# Altium schematic sheet Half_Bridge_Driver.SchDoc
size A; SheetNumber: 6; SheetTotal: 8
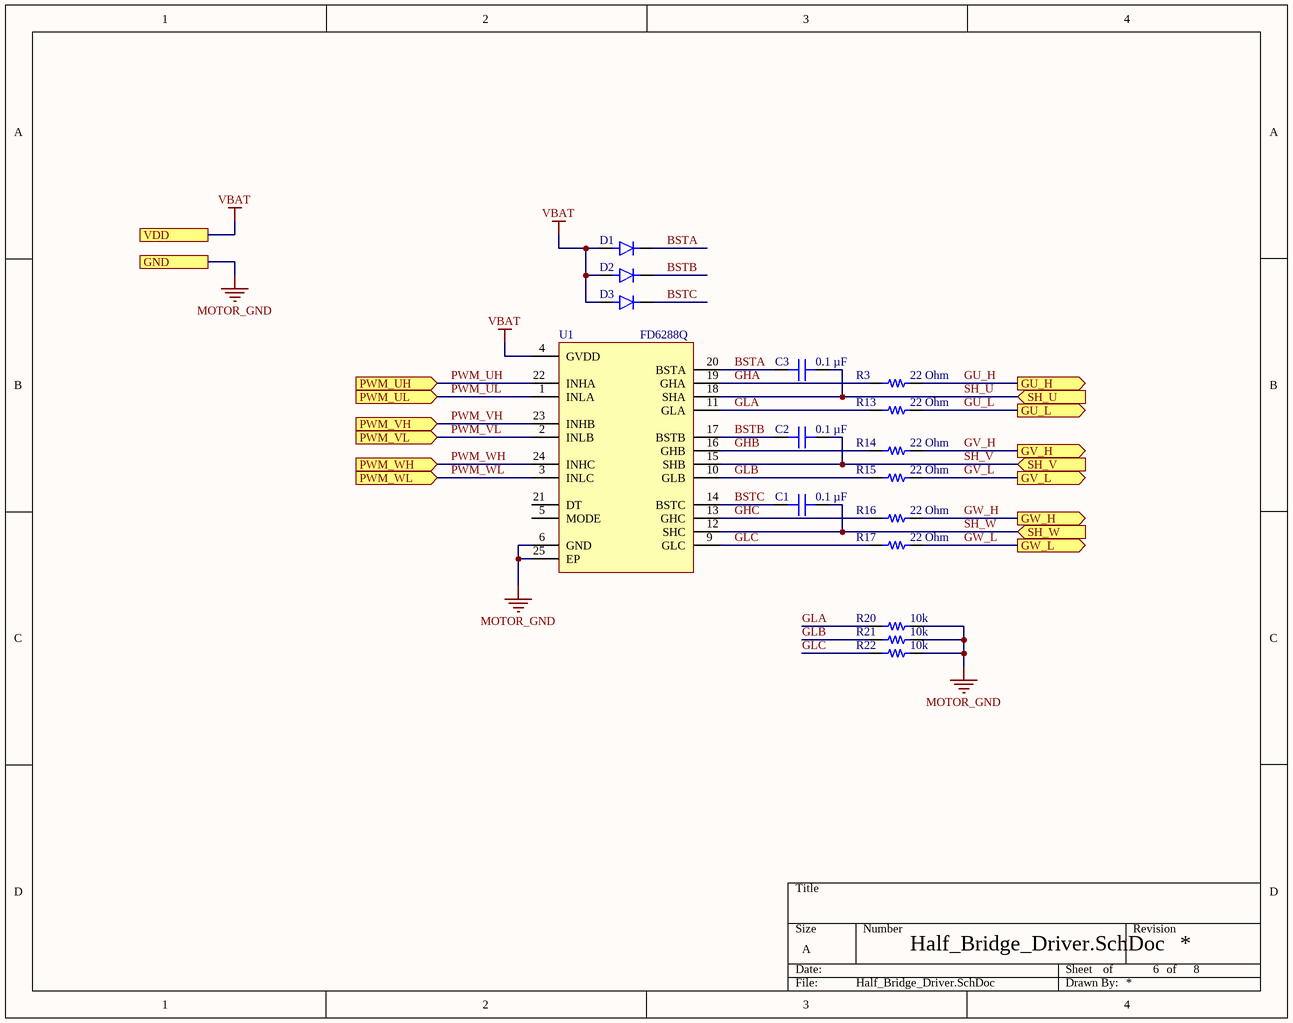
[diagram p0: Half_Bridge_Driver.SchDoc]

## Parts
C1  0.1 µF  [CAP 0201_0603]
C2  0.1 µF  [CAP 0201_0603]
C3  0.1 µF  [CAP 0201_0603]
D1  Diode  [Diode DFN1608D-2 (SOD1608)]  (value not drawn)
D2  Diode  [Diode DFN1608D-2 (SOD1608)]  (value not drawn)
D3  Diode  [Diode DFN1608D-2 (SOD1608)]  (value not drawn)
R3  22 Ohm  [RES 0402_1005]
R13  22 Ohm  [RES 0402_1005]
R14  22 Ohm  [RES 0402_1005]
R15  22 Ohm  [RES 0402_1005]
R16  22 Ohm  [RES 0402_1005]
R17  22 Ohm  [RES 0402_1005]
R20  10k  [RES 0201_0603]
R21  10k  [RES 0201_0603]
R22  10k  [RES 0201_0603]
U1  FD6288Q  [QFN50P400X400X100-25N]

## Ports
GND, GU_H (out), GU_L (out), GV_H (out), GV_L (out), GW_H (out), GW_L (out), PWM_UH (in), PWM_UL (in), PWM_VH (in), PWM_VL (in), PWM_WH (in), PWM_WL (in), SH_U (in), SH_V (in), SH_W (in), VDD

## Nets
MOTOR_GND: R20.2 R21.2 R22.2 U1.6(GND) U1.25(EP) ; port GND
VBAT: D1.2(BLUE(C)) D2.2(BLUE(C)) D3.2(BLUE(C)) U1.4(GVDD) ; port VDD
BSTA: C3.1 D1.1(A) U1.20(BSTA)
BSTB: C2.1 D2.1(A) U1.17(BSTB)
BSTC: C1.1 D3.1(A) U1.14(BSTC)
GHA: R3.1 U1.19(GHA)
GHB: R14.1 U1.16(GHB)
GHC: R16.1 U1.13(GHC)
GLA: R13.1 R20.1 U1.11(GLA)
GLB: R15.1 R21.1 U1.10(GLB)
GLC: R17.1 R22.1 U1.9(GLC)
GU_H: R3.2 ; port GU_H
GU_L: R13.2 ; port GU_L
GV_H: R14.2 ; port GV_H
GV_L: R15.2 ; port GV_L
GW_H: R16.2 ; port GW_H
GW_L: R17.2 ; port GW_L
PWM_UH: U1.22(INHA) ; port PWM_UH
PWM_UL: U1.1(INLA) ; port PWM_UL
PWM_VH: U1.23(INHB) ; port PWM_VH
PWM_VL: U1.2(INLB) ; port PWM_VL
PWM_WH: U1.24(INHC) ; port PWM_WH
PWM_WL: U1.3(INLC) ; port PWM_WL
SH_U: C3.2 U1.18(SHA) ; port SH_U
SH_V: C2.2 U1.15(SHB) ; port SH_V
SH_W: C1.2 U1.12(SHC) ; port SH_W

Not connected (* = marked no-connect by the designer): U1 5(MODE) 21(DT)

## Notes on the sheet
- of

## Library data of the parts
C1-C3 = GRT033R6YA104KE01D: CAP CER 0.1UF 35V X5R 0201; manufacturer: Murata Electronics; Tolerance: ±10%; Part Number: GRT033R6YA104KE01D; Value: 0.1 µF; Applications: Automotive; Capacitance: 0.1 µF; componentlink1description: Datasheet; componentlink1url: https://search.murata.co.jp/Ceramy/image/img/A01X/G101/ENG/GRT033R6YA104KE01-01.pdf; componentlink2description: DigiKey Link; componentlink2url: https://www.digikey.com/en/products/detail/murata-electronics/GRT033R6YA104KE01D/10694796; Device Package: 0201 (0603 Metric); lastupdated: 7/15/2023 7:00:43 PM; Lifecycle Status: Active; Minimum Order: 1; Mounting Type: Surface Mount, MLCC; Operating Temperature: -55°C ~ 85°C; Package / Case: 0201 (0603 Metric); packaging: TapeAndReel; partid: 49925; Part Status: Active; price: 0.01; Ratings: AEC-Q200; series: GRT; Size / Dimension: 0.024" L x 0.012" W (0.60mm x 0.30mm); Supplier 1: DigiKey; Supplier Part Number 1: 490-GRT033R6YA104KE01DCT-ND; Temperature Coefficient: X5R; Thickness (Max): 0.013" (0.33mm); Voltage - Rated: 35V
D1-D3 = Diode: DFN1608D-2 (SOD1608); Manufacturer: Cree; ComponentLink2Description: Datasheet; Temperature: -40°C to +100°C; Package: LED_3MM2X2MM8; Supplier 2: Mouser; Price: 0.203999996142; Supplier 1: Digi-Key; ComponentLink1URL: https://upverter.com/upn/revision/9d0b31f7b1982705/; Supplier Part Number 2: 941-CLV1LFKBC7673673; Supplier Part Number 1: CLV1L-FKB-CHMMQEHBB7673673-ND; ComponentLink1Description: Upverter; ComponentLink2URL: http://www.cree.com/~/media/Files/Cree/LED-Components-and-Modules/HB/Data-Sheets/CLV1L-FKB-1238.pdf; RoHS: TRUE; Mouser Part Number: 941-CLV1LFKBC7673673; Temperature Range High: +100°C; Digikey Description: DIODE LED RGB DIFFUSED 4LCC SMD; Digikey Part Number: CLV1L-FKB-CHMMQEHBB7673673-ND; Lead Free: yes; Temperature Range Low: -40°C
R3 R13-R17 = RK73H1ETTP1432F: RES 14.3K OHM 1% 1/10W 0402; Manufacturer: KOA Speer Electronics, Inc.; Power (Watts): 0.1W, 1/10W; Resistance: 14.3 kOhms; Temperature Coefficient: ±100ppm/°C; Part Number: RK73H1ETTP1432F; Value: 22 Ohm; ComponentLink1Description: Datasheet; ComponentLink1URL: http://www.koaspeer.com/catimages/Products/RK73H/RK73H.pdf; ComponentLink2Description: DigiKey Link; ComponentLink2URL: https://www.digikey.com/en/products/detail/koa-speer-electronics-inc/RK73H1ETTP1432F/9844351; Composition: Thick Film; Device Package: 0402 (1005 Metric); Features: Automotive AEC-Q200, Moisture Resistant; Height - Seated (Max): 0.016" (0.40mm); LastUpdated: 8/14/2022 9:23:49 PM; Lifecycle Status: Active; Minimum Order: 1; Number of Terminations: 2; Operating Temperature: -55°C ~ 155°C; Package / Case: 0402 (1005 Metric); Packaging: CutTape; PartId: 10193; Part Status: Active; Price: 0.01; Ratings: AEC-Q200; Series: RK73H; Size / Dimension: 0.039" L x 0.020" W (1.00mm x 0.50mm); Supplier 1: DigiKey; Supplier Part Number 1: 2019-RK73H1ETTP1432FCT-ND; Supplier Device Package: 0402; Tolerance: ±1%
R20-R22 = CRCW020110K0FKED: RES SMD 10K OHM 1% 1/20W 0201; Manufacturer: Vishay Dale; Power (Watts): 0.05W, 1/20W; Resistance: 10 kOhms; Temperature Coefficient: ±100ppm/°C; Part Number: CRCW020110K0FKED; Value: 10k; ComponentLink1Description: Datasheet; ComponentLink1URL: http://www.vishay.com/docs/20052/crcw0201e3.pdf; ComponentLink2Description: DigiKey Link; ComponentLink2URL: https://www.digikey.com/en/products/detail/vishay-dale/CRCW020110K0FKED/1967989; Composition: Thick Film; Device Package: 0201 (0603 Metric); Height - Seated (Max): 0.010" (0.26mm); LastUpdated: 7/12/2023 7:17:23 PM; Lifecycle Status: Active; Minimum Order: 1; Number of Terminations: 2; Operating Temperature: -55°C ~ 155°C; Package / Case: 0201 (0603 Metric); Packaging: TapeAndReel; PartId: 29; Part Status: Active; Price: 0.02; Series: CRCW; Size / Dimension: 0.024" L x 0.012" W (0.60mm x 0.30mm); Supplier 1: DigiKey; Supplier Part Number 1: 541-10.0KAABCT-ND; Supplier Device Package: 0201; Tolerance: ±1%
U1 = FD6288Q: 3 Phase Gate Driver 1.5-2.2A; MF: Texas Instruments; MP: UCC27282DRCR; Texas_Instruments-Purchase-URL: https://snapeda.com/shop?store=Texas+Instruments&id=3625400; Price: None; Availability: Warning; Package: VSON-10 Texas Instruments; SnapEDA_Link: https://www.snapeda.com/parts/UCC27282DRCR/Texas%20Instruments/view-part/3625400/?ref=snap; DigiKey-Purchase-URL: https://snapeda.com/shop?store=DigiKey&id=3625400; Value: *